# EAGLE schematic MonochromeVGA (EAGLE 7.6.0)
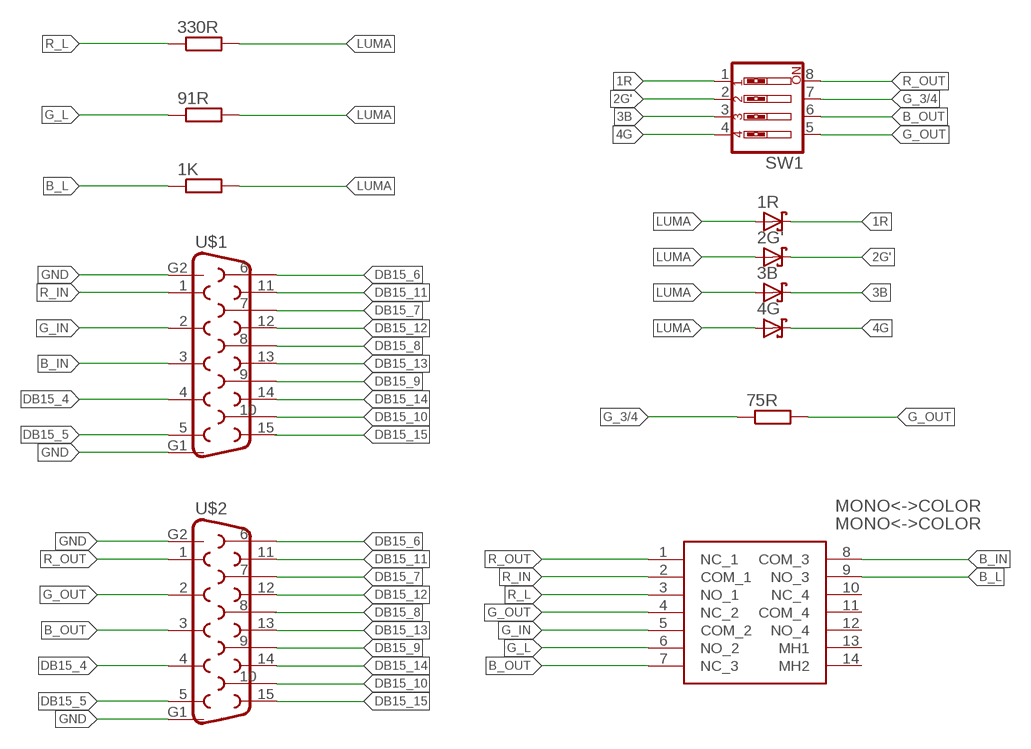
[diagram p0: schematic, sheet 1]

## Parts
1K  R-EU_0204/5  [0204/5]
1R  SCHOTTKY-DIODEDO35-7  [DO35-7]
2G'  SCHOTTKY-DIODEDO35-7  [DO35-7]
3B  SCHOTTKY-DIODEDO35-7  [DO35-7]
4G  SCHOTTKY-DIODEDO35-7  [DO35-7]
75R  R-EU_0204/5  [0204/5]
91R  R-EU_0204/5  [0204/5]
330R  R-EU_0204/5  [0204/5]
MONO<->COLOR  MONO<->COLOR  EG4208A  [EG4208A]
SW1  SW_DIP-4  [EDG-04]
U$1  DB15  [DB15]
U$2  DB15  [DB15]

## Nets
1R: 1R.C SW1.1
2G': 2G'.C SW1.2
3B: 3B.C SW1.3
4G: 4G.C SW1.4
B_IN: MONO<->COLOR.8(COM_3) U$1.3
B_L: 1K.1 MONO<->COLOR.9(NO_3)
B_OUT: MONO<->COLOR.7(NC_3) SW1.6 U$2.3
DB15_4: U$1.4 U$2.4
DB15_5: U$1.5 U$2.5
DB15_6: U$1.6 U$2.6
DB15_7: U$1.7 U$2.7
DB15_8: U$1.8 U$2.8
DB15_9: U$1.9 U$2.9
DB15_10: U$1.10 U$2.10
DB15_11: U$1.11 U$2.11
DB15_12: U$1.12 U$2.12
DB15_13: U$1.13 U$2.13
DB15_14: U$1.14 U$2.14
DB15_15: U$1.15 U$2.15
G_3/4: 75R.1 SW1.7
G_IN: MONO<->COLOR.5(COM_2) U$1.2
G_L: 91R.1 MONO<->COLOR.6(NO_2)
G_OUT: 75R.2 MONO<->COLOR.4(NC_2) SW1.5 U$2.2
GND: U$1.G1(G2) U$1.G2(G1) U$2.G1(G2) U$2.G2(G1)
LUMA: 1K.2 1R.A 2G'.A 3B.A 4G.A 91R.2 330R.2
R_IN: MONO<->COLOR.2(COM_1) U$1.1
R_L: 330R.1 MONO<->COLOR.3(NO_1)
R_OUT: MONO<->COLOR.1(NC_1) SW1.8 U$2.1
Unconnected: MONO<->COLOR.10(NC_4) MONO<->COLOR.11(COM_4) MONO<->COLOR.12(NO_4) MONO<->COLOR.13(MH1) MONO<->COLOR.14(MH2)

## Library data of the parts
1K 75R 91R 330R = resistor:R-EU_: RESISTOR, European symbol
1R 2G' 3B 4G = diode:SCHOTTKY-DIODE: Schottky Diode
MONO<->COLOR = EG4208A:EG4208A: Slide Switches 4P2T SIDE OP PC MNT Source: Datasheet <https://www.e-switch.com/system/asset/product_line/data_sheet/119/EG.pdf>; DESCRIPTION: Slide Switches 4P2T SIDE OP PC MNT; HEIGHT: 5mm; MANUFACTURER_NAME: E-Switch; MANUFACTURER_PART_NUMBER: EG4208A; MOUSER_PART_NUMBER: 612-EG4208A; MOUSER_PRICE-STOCK: https://www.mouser.com/Search/Refine.aspx?Keyword=612-EG4208A
SW1 = special:SW_DIP-4: DIP SWITCH
U$1 U$2 = SparkFun-Connectors:DB15: DB15 / VGA right angle through-hole female connector.